# EasyEDA Pro project OctoSlime_Haptics_LED_Driver_Imported.eprj

# Schematic OctoSlime
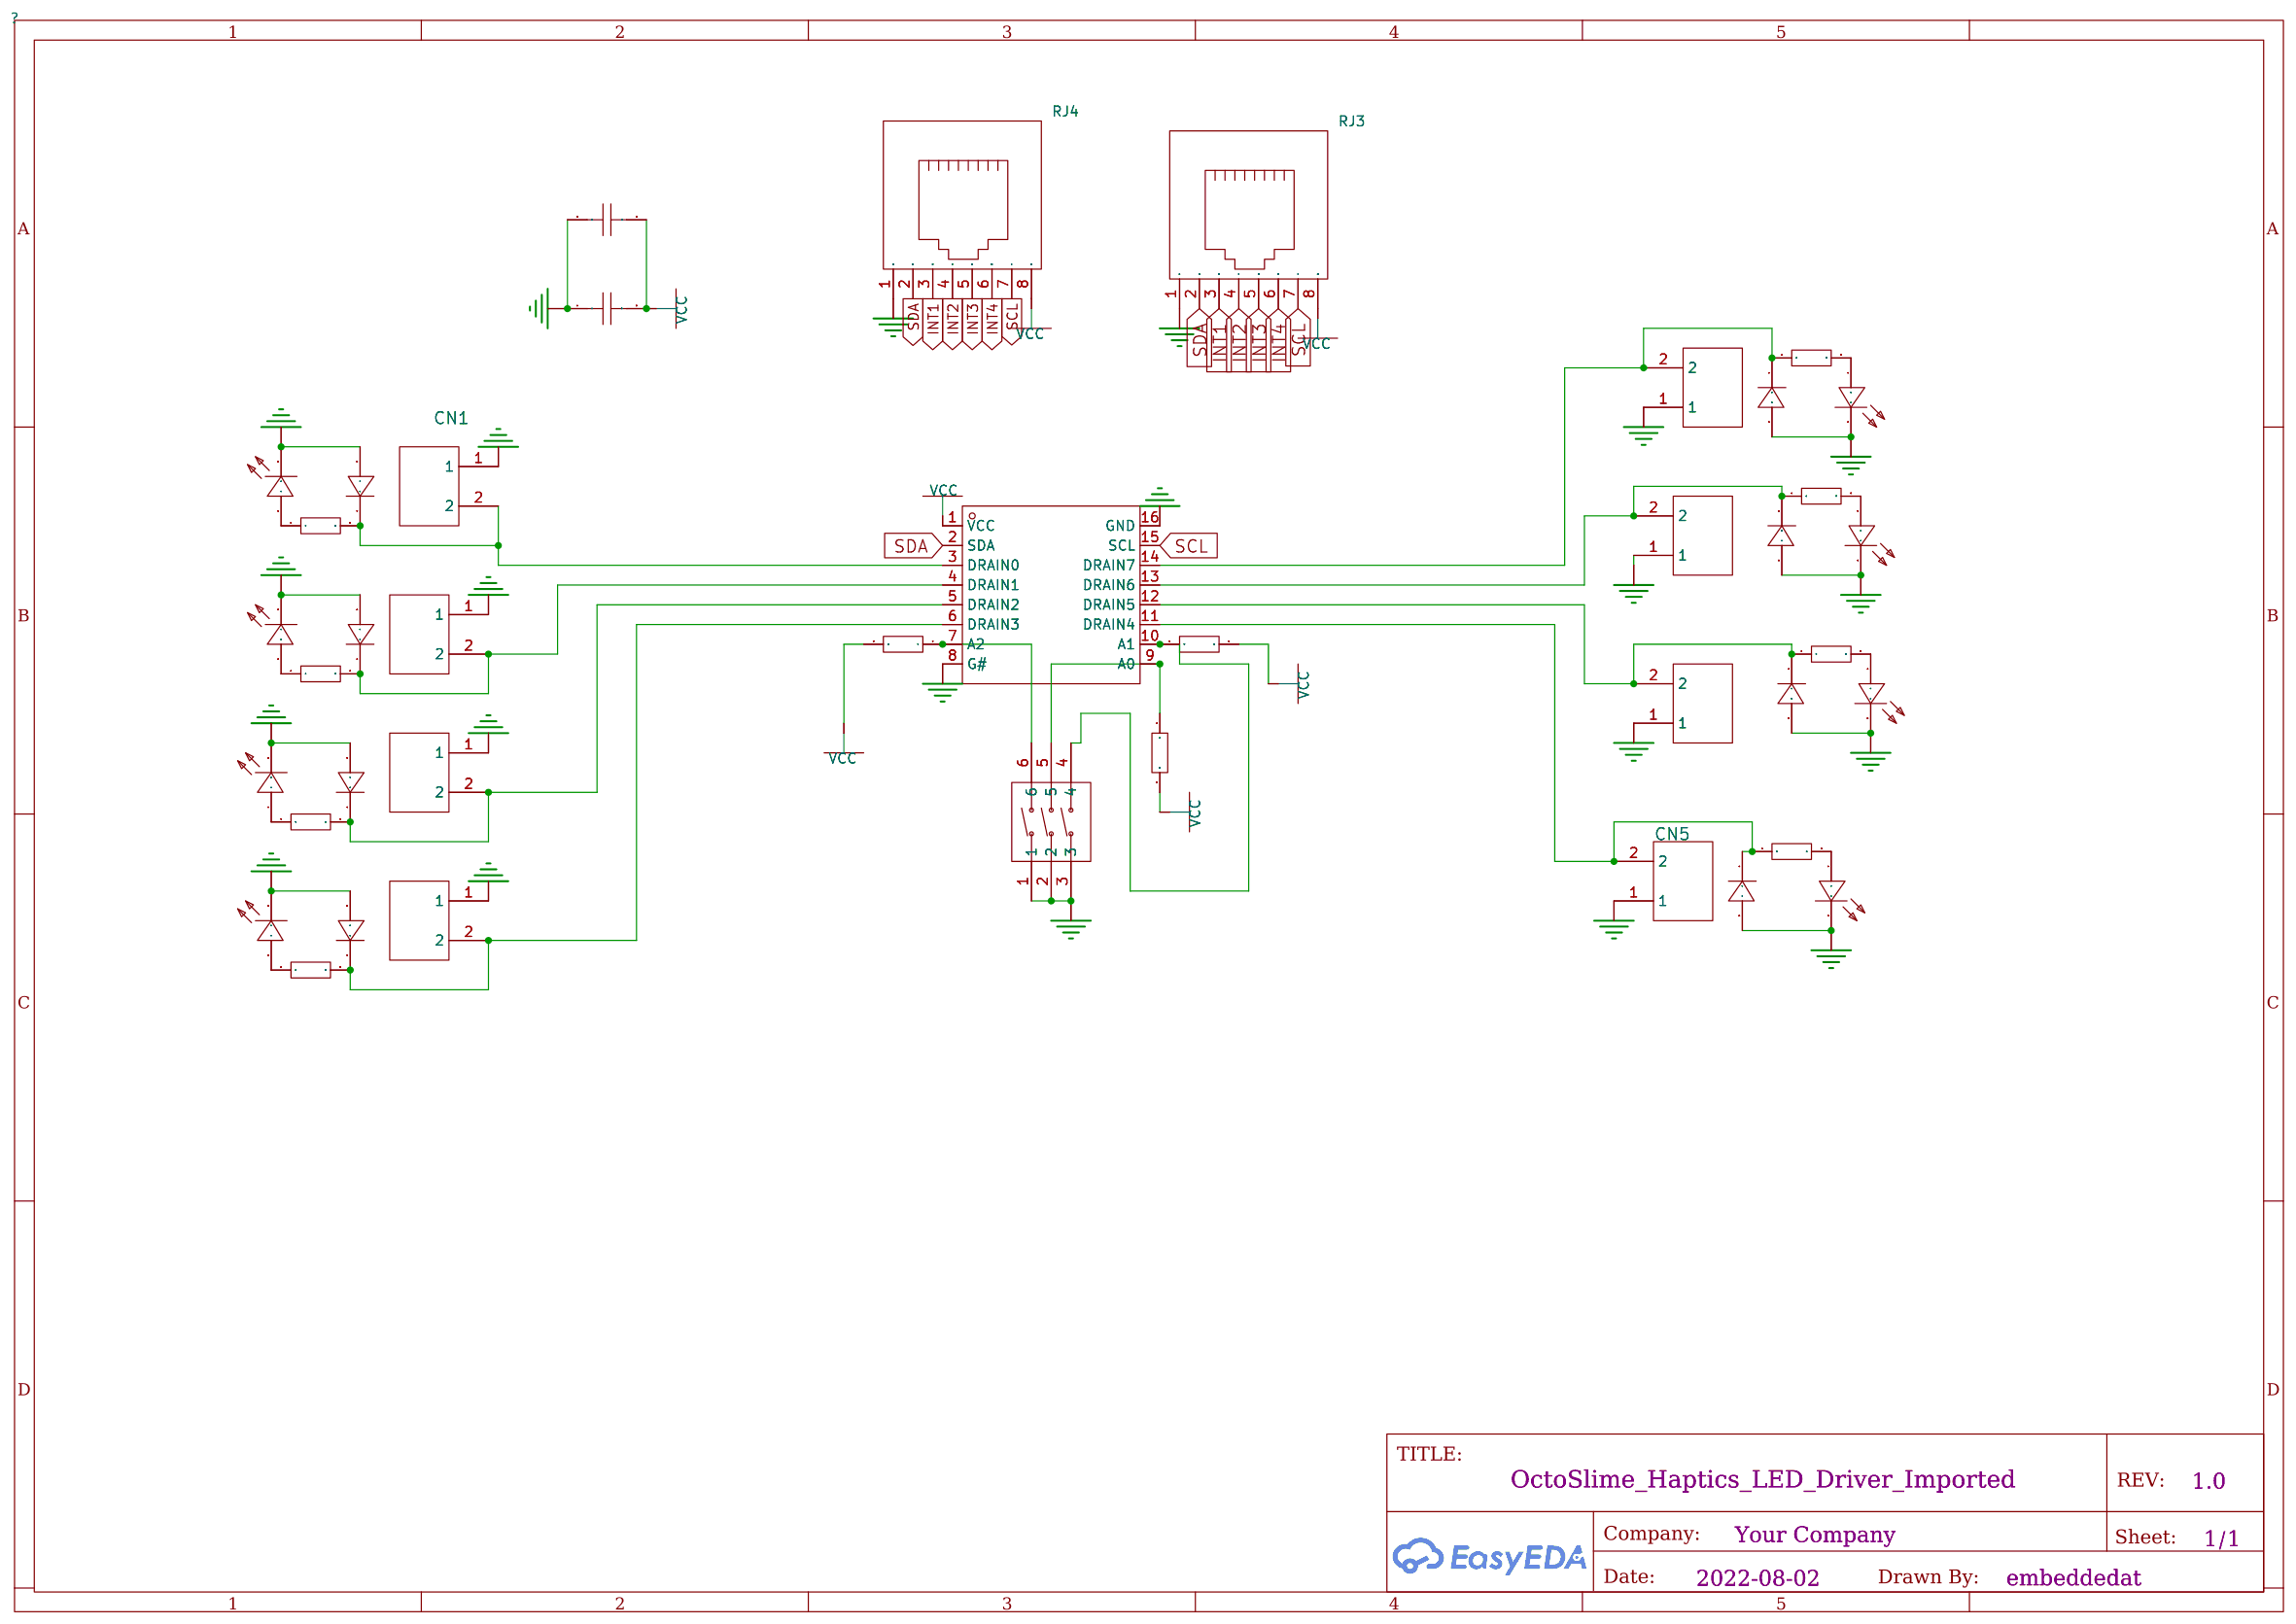
[diagram p0: schematic sheet]

## Parts
C3  47uF  [C1206]
C4  100nF  [C0402]
CN1  B2B-PH-K-S(LF)(SN)  [CONN-TH_B2B-PH-K-S]
CN2  B2B-PH-K-S(LF)(SN)  [CONN-TH_B2B-PH-K-S]
CN3  B2B-PH-K-S(LF)(SN)  [CONN-TH_B2B-PH-K-S]
CN4  B2B-PH-K-S(LF)(SN)  [CONN-TH_B2B-PH-K-S]
CN5  B2B-PH-K-S(LF)(SN)  [CONN-TH_B2B-PH-K-S]
CN6  B2B-PH-K-S(LF)(SN)  [CONN-TH_B2B-PH-K-S]
CN7  B2B-PH-K-S(LF)(SN)  [CONN-TH_B2B-PH-K-S]
CN8  B2B-PH-K-S(LF)(SN)  [CONN-TH_B2B-PH-K-S]
D9  -  [DO-214AC_L4.3-W2.7-LS5.3-RD]
D10  -  [DO-214AC_L4.3-W2.7-LS5.3-RD]
D11  -  [DO-214AC_L4.3-W2.7-LS5.3-RD]
D12  -  [DO-214AC_L4.3-W2.7-LS5.3-RD]
D13  -  [DO-214AC_L4.3-W2.7-LS5.3-RD]
D14  -  [DO-214AC_L4.3-W2.7-LS5.3-RD]
D15  -  [DO-214AC_L4.3-W2.7-LS5.3-RD]
D16  -  [DO-214AC_L4.3-W2.7-LS5.3-RD]
LED9  -  [LED0603-R-RD]
LED10  -  [LED0603-R-RD]
LED11  -  [LED0603-R-RD]
LED12  -  [LED0603-R-RD]
LED13  -  [LED0603-R-RD]
LED14  -  [LED0603-R-RD]
LED15  -  [LED0603-R-RD]
LED16  -  [LED0603-R-RD]
R1  1kΩ  [R0603]
R2  1kΩ  [R0603]
R12  330Ω  [R0603]
R13  330Ω  [R0603]
R14  330Ω  [R0603]
R15  330Ω  [R0603]
R16  330Ω  [R0603]
R17  330Ω  [R0603]
R18  330Ω  [R0603]
R19  330Ω  [R0603]
R20  1kΩ  [R0603]
RJ3  -  [RJ45-TH_R-RJ45R08P-A004]
RJ4  -  [RJ45-TH_R-RJ45R08P-A004]
SW1  EM-03KP  [SW-SMD_EM-03KP]
U1  TPIC2810DRG4  [SOIC-16_L9.9-W3.9-P1.27-LS6.0-BL]  (no BOM)

## Library data of the parts
C3 = CL31A476MPHNNNE: 容值:47uF;精度:±20%;额定电压:10V;温度系数:X5R;; LCSC Part Name: 47uF ±20% 10V; Supplier Part: C96123; Manufacturer: SAMSUNG(三星); Supplier Footprint: 1206; JLCPCB Part Class: Basic Part; Datasheet: https://atta.szlcsc.com/upload/public/pdf/source/20170228/1488267692219.pdf; Supplier: LCSC; Tolerance: ±20%; Voltage Rated: 10V; Temperature Coefficient: X5R
C4 = CL05B104KB54PNC: 容值:100nF;精度:±10%;额定电压:50V;温度系数:X7R;; LCSC Part Name: 100nF ±10% 50V; Supplier Part: C307331; Manufacturer: SAMSUNG(三星); Supplier Footprint: 0402; JLCPCB Part Class: Basic Part; Datasheet: https://atta.szlcsc.com/upload/public/pdf/source/20181009/C307331_222F7C870FD3EA5F46F538B483443886.pdf; Supplier: LCSC; Tolerance: ±10%; Voltage Rated: 50V; Temperature Coefficient: X7R
CN1-CN8 = B2B-PH-K-S(LF)(SN): link: https://item.szlcsc.com/142630.html; 3DModel: CONN-TH_PH2.00-LI-2P; Supplier: LCSC; Manufacturer: JST; Supplier Part: C131337; JLCPCB Part Class: Extended Part
D9-D16 = M7_C95872: 二极管配置:-;直流反向耐压(Vr):1kV;平均整流电流(Io):1A;正向压降(Vf):1.1V@1A;反向电流(Ir):5A@1kV;; LCSC Part Name: 1kV 1A 1.1V@1A GPP; Supplier Part: C95872; Manufacturer: MDD; Manufacturer Part: M7; Supplier Footprint: SMA(DO-214AC); JLCPCB Part Class: Basic Part; Datasheet: https://atta.szlcsc.com/upload/public/pdf/source/20170221/1487670316366.pdf; Supplier: LCSC; Reverse Voltage (Vr): 1kV; Average Rectified Current (Io): 1A; Forward Voltage (Vf@If): 1.1V@1A; Reverse Leakage Current: 5A@1kV
LED9-LED16 = KT-0603R: 发光颜色:红灯;二极管配置:-;透镜颜色:-;主波长:-;峰值波长:-;色温:-;光通量(25时):-;测试电流:-;正向电压(VF):-;发光强度:-;功率:-;发光角度:-;安装方式:-;工作温度:-40~+85;; LCSC Part Name: 红灯 0603 (90~100mcd); Supplier Part: C2286; Manufacturer: KENTO; Supplier Footprint: 0603; JLCPCB Part Class: Basic Part; Datasheet: https://atta.szlcsc.com/upload/public/pdf/source/20160616/1466072038404.pdf; Supplier: LCSC; Emitted Color: 红灯; Operating Temperature: -40~+85
R1 R2 R20 = 0603WAF1001T5E: 电阻类型:厚膜电阻;阻值:1kΩ;精度:±1%;功率:1/10W;温度系数:±100ppm/;最大工作电压:75V;工作温度范围:-55~+155;; LCSC Part Name: 1kΩ ±1%; Supplier Part: C21190; Manufacturer: UNI-ROYAL(厚声); Supplier Footprint: 0603; JLCPCB Part Class: Basic Part; Datasheet: https://atta.szlcsc.com/upload/public/pdf/source/20200306/C422600_1E6D84923E4A46A82E41ADD87F860B5C.pdf; Supplier: LCSC; Type: 厚膜电阻; Tolerance: ±1%; Power(Watts): 1/10W; Temperature Coefficient: ±100ppm/; Overload Voltage (Max): 75V; Operating Temperature Range: -55~+155
R12-R19 = 0603WAF3300T5E: 电阻类型:厚膜电阻;阻值:330Ω;精度:±1%;功率:1/10W;温度系数:±100ppm/;最大工作电压:75V;工作温度范围:-55~+155;; LCSC Part Name: 330Ω ±1%; Supplier Part: C23138; Manufacturer: UNI-ROYAL(厚声); Supplier Footprint: 0603; JLCPCB Part Class: Basic Part; Datasheet: https://atta.szlcsc.com/upload/public/pdf/source/20200306/C422600_1E6D84923E4A46A82E41ADD87F860B5C.pdf; Supplier: LCSC; Type: 厚膜电阻; Tolerance: ±1%; Power(Watts): 1/10W; Temperature Coefficient: ±100ppm/; Overload Voltage (Max): 75V; Operating Temperature Range: -55~+155
RJ3 RJ4 = R-RJ45R08P-A004: 连接器类型:RJ插座;USOC代码:RJ45;端口数量:1;等级:-;安装方式:弯插;屏蔽:无;LED:无;工作温度范围:0~+70;; LCSC Part Name: RJ45 8P/8C 全塑 无灯; Supplier Part: C385834; Manufacturer: Ckmtw(灿科盟); Supplier Footprint: 插件; JLCPCB Part Class: Extended Part; Datasheet: https://atta.szlcsc.com/upload/public/pdf/source/20210127/C385834_05A472B070A4DC4A7A2338A5364B5FF5.pdf; Supplier: LCSC; Connector Type: RJ插座; USOC Codes: RJ45; Number of Ports: 1; Mounting Style: 弯插; Shielding: 无; LED: 无; Operating Temperature Range: 0~+70
SW1 = EM-03KP: link: https://item.szlcsc.com/140371.html; 3DModel: SW-SMD_EM-03KP-L8.6-W6.3-H4.8-P2.54-LS10.0; Supplier: LCSC; Manufacturer: HRO; Supplier Part: C129079; JLCPCB Part Class: Extended Part
U1 = TPIC2810DRG4: 3DModel: SOIC-16_L9.9-W3.9-H1.8-LS6.0-P1.27; Supplier: LCSC; Supplier Part: C2678987; Manufacturer: TI(德州仪器); JLCPCB Part Class: Extended Part

## Nets
GND: C3.1 C4.1 CN1.1 CN2.1 CN3.1 CN4.1 CN5.1 CN6.1 CN7.1 CN8.1 D9.2(A) D10.2(A) D11.2(A) D12.2(A) D13.2(A) D14.2(A) D15.2(A) D16.2(A) LED9.2(K) LED10.2(K) LED11.2(K) LED12.2(K) LED13.2(K) LED14.2(K) LED15.2(K) LED16.2(K) RJ3.1 RJ4.1 SW1.1 SW1.2 SW1.3 U1.8(G#) U1.16(GND)
VCC: C3.2 C4.2 R1.2 R2.2 R20.1 RJ3.8 RJ4.8 U1.1(VCC)
INT1: RJ3.3 RJ4.3
INT2: RJ3.4 RJ4.4
INT3: RJ3.5 RJ4.5
INT4: RJ3.6 RJ4.6
SCL: RJ3.7 RJ4.7 U1.15(SCL)
SDA: RJ3.2 RJ4.2 U1.2(SDA)
$1N1698: R20.2 SW1.4 U1.10(A1)
$1N1704: R1.1 SW1.5 U1.9(A0)
$1N1718: R2.1 SW1.6 U1.7(A2)
$1N1725: CN1.2 D16.1(K) R19.2 U1.3(DRAIN0)
$1N1741: CN2.2 D15.1(K) R18.2 U1.4(DRAIN1)
$1N1752: CN3.2 D14.1(K) R17.2 U1.5(DRAIN2)
$1N1760: CN4.2 D13.1(K) R16.2 U1.6(DRAIN3)
$1N1840: CN8.2 D12.1(K) R12.1 U1.14(DRAIN7)
$1N1848: CN7.2 D11.1(K) R13.1 U1.13(DRAIN6)
$1N1856: CN6.2 D10.1(K) R14.1 U1.12(DRAIN5)
$1N1864: CN5.2 D9.1(K) R15.1 U1.11(DRAIN4)
$1N7443: LED12.1(A) R15.2
$1N7487: LED11.1(A) R14.2
$1N7531: LED10.1(A) R13.2
$1N7596: LED9.1(A) R12.2
$1N7750: LED16.1(A) R16.1
$1N7776: LED15.1(A) R17.1
$1N7810: LED14.1(A) R18.1
$1N7836: LED13.1(A) R19.1

# Board PCB_PCB_OctoSlime_2022-08-02
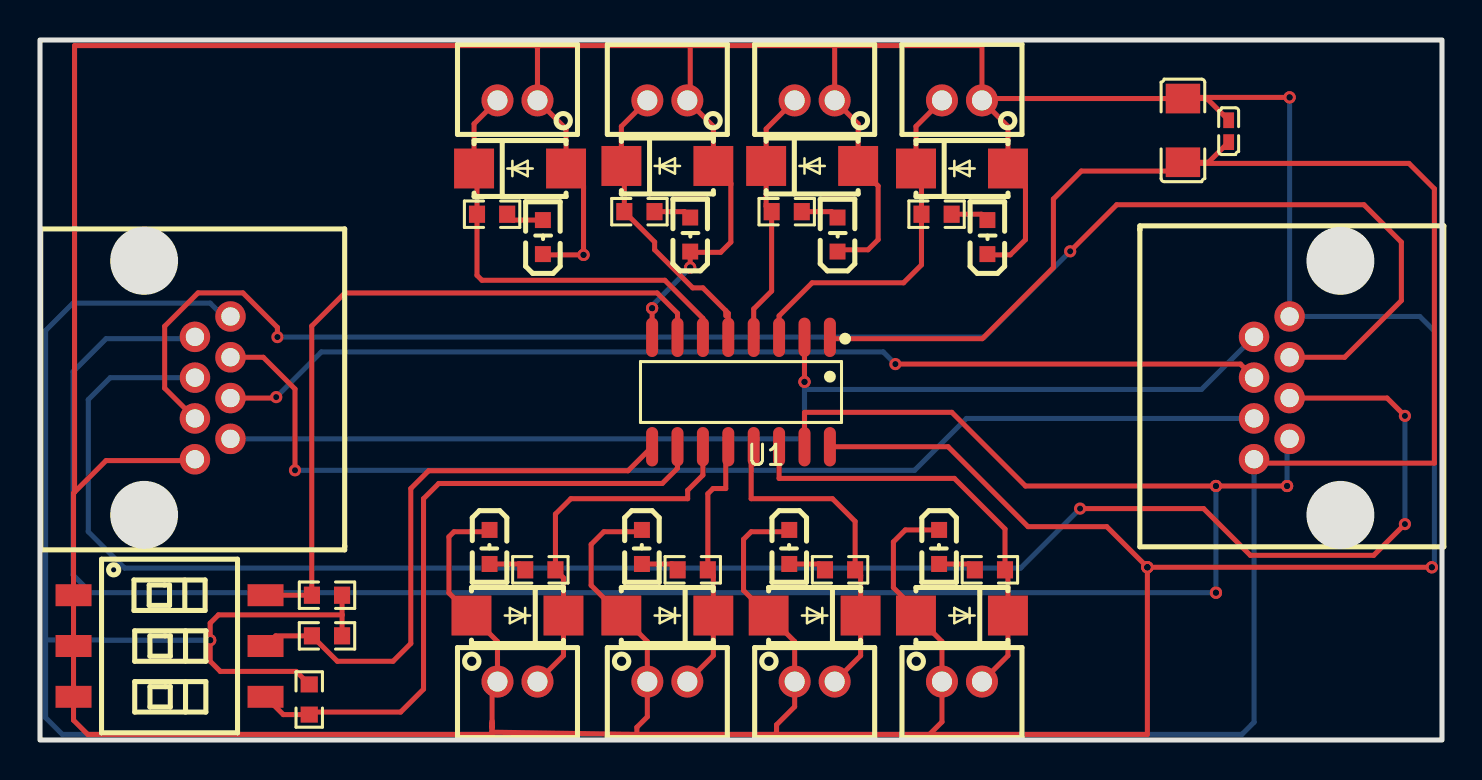
[diagram p1: board, top side]
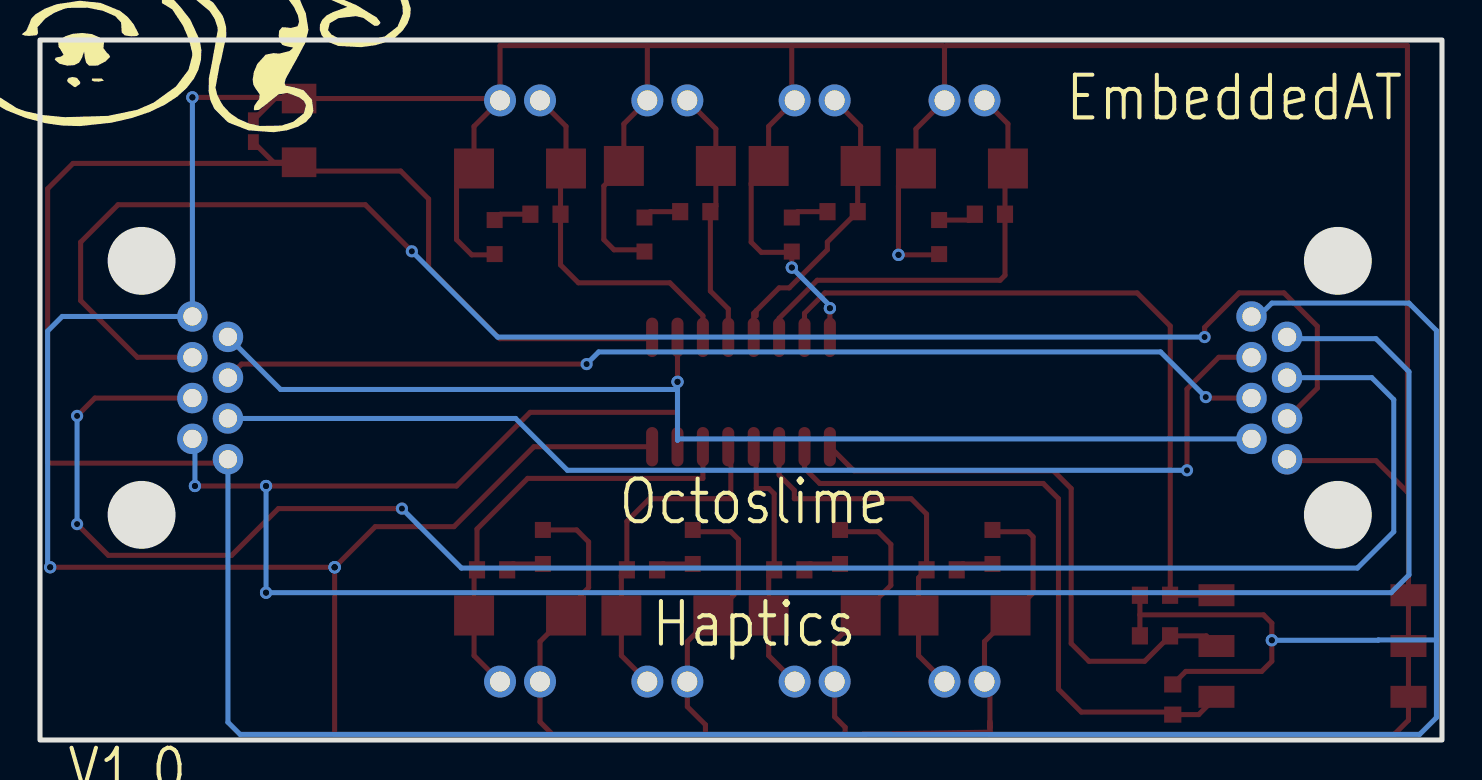
[diagram p2: board, bottom side, seen from below]

Outline 70.1 x 35 mm; copper layers: Top Layer, Bottom Layer. Coordinates in mm from the lower left corner of the outline.
Outline path: rectangle 0,35 70.1,0
Stack: Top Layer 0.035mm / Dielectric1 1.51mm FR4 er 4.5 / Bottom Layer 0.035mm

## Design rules (mm)
spacing Default (default): track to track 0.152, other pairs 0 to 0.152
track width Default (default): min 0.254, default 0.254, max 25.4
differential pair differentialPair (default): width min 0.127, default 0.254, max 2.54; gap min 0.152, default 0.152
via Default (default): diameter min 0.61, default 0.61, max 100.025; hole min 0.305, default 0.305, max 59.995

## Placement (name value [footprint] x y rotation side)
C3  47uF  [C1206]  57.15 30.48 270 top
C4  100nF  [C0402]  59.44 30.44 270 top
CN1  B2B-PH-K-S(LF)(SN)  [CONN-TH_B2B-PH-K-S]  46.1 31.98 0 top
CN2  B2B-PH-K-S(LF)(SN)  [CONN-TH_B2B-PH-K-S]  38.73 31.98 0 top
CN3  B2B-PH-K-S(LF)(SN)  [CONN-TH_B2B-PH-K-S]  31.37 31.98 0 top
CN4  B2B-PH-K-S(LF)(SN)  [CONN-TH_B2B-PH-K-S]  23.88 31.98 0 top
CN5  B2B-PH-K-S(LF)(SN)  [CONN-TH_B2B-PH-K-S]  23.88 2.92 180 top
CN6  B2B-PH-K-S(LF)(SN)  [CONN-TH_B2B-PH-K-S]  31.37 2.92 180 top
CN7  B2B-PH-K-S(LF)(SN)  [CONN-TH_B2B-PH-K-S]  38.73 2.92 180 top
CN8  B2B-PH-K-S(LF)(SN)  [CONN-TH_B2B-PH-K-S]  46.1 2.92 180 top
D9  -  [DO-214AC_L4.3-W2.7-LS5.3-RD]  23.88 6.22 180 top
D10  -  [DO-214AC_L4.3-W2.7-LS5.3-RD]  31.37 6.22 180 top
D11  -  [DO-214AC_L4.3-W2.7-LS5.3-RD]  38.73 6.22 180 top
D12  -  [DO-214AC_L4.3-W2.7-LS5.3-RD]  46.1 6.22 180 top
D13  -  [DO-214AC_L4.3-W2.7-LS5.3-RD]  24 28.58 0 top
D14  -  [DO-214AC_L4.3-W2.7-LS5.3-RD]  31.37 28.7 0 top
D15  -  [DO-214AC_L4.3-W2.7-LS5.3-RD]  38.61 28.7 0 top
D16  -  [DO-214AC_L4.3-W2.7-LS5.3-RD]  46.1 28.58 0 top
LED9  -  [LED0603-R-RD]  44.96 9.65 270 top
LED10  -  [LED0603-R-RD]  37.46 9.65 270 top
LED11  -  [LED0603-R-RD]  30.1 9.65 270 top
LED12  -  [LED0603-R-RD]  22.48 9.65 270 top
LED13  -  [LED0603-R-RD]  47.37 25.15 90 top
LED14  -  [LED0603-R-RD]  39.88 25.27 90 top
LED15  -  [LED0603-R-RD]  32.51 25.27 90 top
LED16  -  [LED0603-R-RD]  25.15 25.15 90 top
R1  1kΩ  [R0603]  14.35 5.21 0 top
R2  1kΩ  [R0603]  14.35 7.24 0 top
R12  330Ω  [R0603]  47.5 8.51 180 top
R13  330Ω  [R0603]  40.01 8.51 180 top
R14  330Ω  [R0603]  32.64 8.51 180 top
R15  330Ω  [R0603]  25.02 8.51 180 top
R16  330Ω  [R0603]  22.61 26.29 180 top
R17  330Ω  [R0603]  29.97 26.42 180 top
R18  330Ω  [R0603]  37.34 26.42 180 top
R19  330Ω  [R0603]  44.83 26.29 180 top
R20  1kΩ  [R0603]  13.46 2.02 270 top
RJ3  -  [RJ45-TH_R-RJ45R08P-A004]  61.59 17.61 90 top
RJ4  -  [RJ45-TH_R-RJ45R08P-A004]  8.64 17.61 270 top
SW1  EM-03KP  [SW-SMD_EM-03KP]  6.48 4.7 270 top
U1  TPIC2810DRG4  [SOIC-16_L9.9-W3.9-P1.27-LS6.0-BL]  35.05 17.4 180 top

## Footprints (pads in the part's own frame, mm; a bottom-side part is the same pattern mirrored in y, then rotated)
C0402
  rect 0.79x0.541 smd: 1(-0.546,0) 2(0.546,0)
C1206
  rect 1.486x1.727 smd: 1(-1.593,0) 2(1.593,0)
CONN-TH_B2B-PH-K-S
  round 1.6 hole 1: 1(1,0) 2(-1,0)
DO-214AC_L4.3-W2.7-LS5.3-RD
  rect 1.999x1.999 smd: 1(-2.299,0) 2(2.301,0)
LED0603-R-RD
  rect 0.8x0.8 smd: 1(0.851,0) 2(-0.851,0)
R0603
  rect 0.807x0.864 smd: 1(-0.754,0) 2(0.754,0)
RJ45-TH_R-RJ45R08P-A004
  round 1.524 hole 0.914: 1(3.571,-0.889) 2(2.55,0.889) 3(1.529,-0.889) 4(0.51,0.889) 5(-0.51,-0.889) 6(-1.529,0.889) 7(-2.55,-0.889) 8(-3.568,0.889)
SOIC-16_L9.9-W3.9-P1.27-LS6.0-BL
  oval 0.602x1.971 smd: 1(-4.445,-2.736) 2(-3.175,-2.736) 3(-1.905,-2.736) 4(-0.635,-2.736) 5(0.635,-2.736) 6(1.905,-2.736) 7(3.175,-2.736) 8(4.445,-2.736) 9(4.445,2.736) 10(3.175,2.736) 11(1.905,2.736) 12(0.635,2.736) 13(-0.635,2.736) 14(-1.905,2.736) 15(-3.175,2.736) 16(-4.445,2.736)
SW-SMD_EM-03KP
  rect 1.1x1.8 smd: 1(-2.54,-4.8) 2(0,-4.8) 3(2.54,-4.8) 4(2.54,4.8) 5(0,4.8) 6(-2.54,4.8)

## Nets
As in the schematic.

## Via types
v1: diameter 0.61, hole 0.305, Top Layer to Bottom Layer, 32 vias

## Routing (per net, layer and track width the routed paths; a pad name or vN(x,y) marks a point on that pad's centre or on a via; arc(x,y) is an arc through that point)
GND: length 340.8
  Top Layer w0.254: LED11.2 30.01,10.41 28.19,10.41 27.56,9.78 27.56,7.73 D10.2 30.37,4.92 CN6.1 30.37,1.16 29.84,0.64 29.84,0.28 ; 44.48,0.28 36.73,0.28 ; 44.48,0.28 45.1,0.91 CN8.1 45.1,4.92 D12.2 43.8,6.49 42.67,7.62 42.67,9.91 43.27,10.5 LED9.2 ; 44.48,0.28 55.37,0.28 v1(55.37,8.64) ; 36.73,0.28 29.84,0.28 ; 36.73,0.28 36.83,0.38 36.83,0.76 37.73,1.67 CN7.1 37.73,4.92 D11.2 35.18,7.48 35.18,10.03 35.56,10.41 37.38,10.41 LED10.2 ; 29.84,0.28 22.6,0.39 ; 22.6,0.82 22.6,0.7 ; 22.6,0.82 22.61,0.93 ; 22.6,0.82 22.6,0.82 22.6,0.7 ; 22.6,0.7 22.61,0.7 22.61,0.64 22.6,0.63 ; 22.6,0.7 22.6,0.63 ; LED14.2 39.97,24.51 41.4,24.51 41.91,25.02 41.91,27.7 D15.2 40.91,30.81 CN2.1 39.73,34.72 ; RJ4.1 7.68,13.97 3.3,13.97 1.73,12.4 ; 39.73,34.72 32.51,34.72 ; 39.73,34.72 47.1,34.72 CN1.1 ; 32.51,34.72 32.51,32.12 CN3.1 33.67,30.68 33.67,28.7 34.54,27.83 34.54,24.89 34.04,24.38 32.55,24.38 LED15.2 v1(32.51,23.62) ; 32.51,34.72 24.97,34.72 24.88,34.63 ; v1(55.37,8.64) 53.34,10.67 49.4,10.67 45.41,14.66 U1.16 ; v1(55.37,8.64) v1(69.6,8.64) ; 57.54,32.07 C3.1 47.19,32.07 CN1.1 ; 57.54,32.07 57.59,32.13 v1(62.48,32.13) ; 57.54,32.07 58.35,32.07 C4.1 ; LED16.2 25.18,24.26 v1(27.18,24.26) 27.18,27.7 D13.2 26.3,30.55 CN4.1 24.88,34.63 ; 22.61,0.93 22.61,0.83 ; 22.61,0.93 22.61,2.65 CN5.1 22.88,4.92 D9.2 20.45,7.35 20.45,10.16 20.7,10.41 22.39,10.41 LED12.2 ; 22.6,0.39 22.6,0.39 22.6,0.63 ; 22.6,0.39 22.6,0.63 ; 22.6,0.39 22.6,0.28 2.39,0.28 1.68,0.99 SW1.3 SW1.2 SW1.1 1.68,12.34 1.73,12.4 ; CN1.1 48.4,30.68 48.4,28.58 49.28,27.7 49.28,25.02 48.51,24.26 47.41,24.26 LED13.2 ; 24.88,34.63 24.78,34.72 1.73,34.72 1.73,12.4 ; v1(30.61,21.59) U1.8
  Bottom Layer w0.254: v1(32.51,23.62) 30.61,21.72 v1(30.61,21.59) ; v1(62.48,32.13) RJ3.1 68.99,21.18 69.72,20.45 69.72,8.76 v1(69.6,8.64)
VCC: length 189.6
  Top Layer w0.254: 57.49,28.89 57.55,28.83 68.45,28.83 69.72,27.56 69.72,13.84 60.9,13.84 60.71,14.04 ; 57.49,28.89 58.43,28.89 C4.2 ; 57.49,28.89 C3.2 56.71,28.45 52.07,28.45 50.67,27.05 50.67,23.62 47.12,20.07 39.57,20.07 U1.1 ; R2.2 15.11,6.26 ; 15.11,6.26 8.92,6.26 8.51,5.84 v1(8.51,4.99) 8.51,3.94 9.02,3.43 12.81,3.43 R20.1 ; 15.11,6.26 R1.2
  Bottom Layer w0.254: v1(8.51,4.99) 3.19,4.99 3.18,5 0.28,5 ; 0.28,5 0.28,1.12 1.12,0.28 60.1,0.28 60.71,0.89 60.71,14.04 ; 0.28,5 0.28,20.47 1.65,21.84 8.51,21.84 9.18,21.18 RJ4.8
INT1: length 82.2
  Top Layer w0.254: v1(51.51,24.44) 53.84,26.76 66.2,26.76 68.07,24.89 68.07,21.97 65.24,19.14 RJ3.3 ; RJ4.3 6.23,17.59 6.23,20.69 7.9,22.36 10.15,22.36 11.87,20.63 v1(11.87,20.15)
  Bottom Layer w0.254: v1(51.51,24.44) 47.22,20.15 v1(11.87,20.15)
INT2: length 52.7
  Top Layer w0.254: RJ4.4 11.76,17.1 v1(11.81,17.14) ; 60.71,18.12 60.03,18.8 v1(42.77,18.8)
  Bottom Layer w0.254: v1(11.81,17.14) 14.07,19.4 42.16,19.4 v1(42.77,18.8)
INT3: length 93.4
  Top Layer w0.254: v1(68.25,10.8) 66.69,9.23 60.52,9.23 58.18,11.57 v1(52.01,11.57) ; v1(68.25,16.2) 67.36,17.1 RJ3.5
  Bottom Layer w0.254: RJ4.5 3.51,18.12 2.41,17.02 2.41,10.41 4.23,8.6 49.03,8.6 v1(52.01,11.57) ; v1(68.25,10.8) v1(68.25,16.2)
INT4: length 57
  Top Layer w0.254: RJ4.6 11.16,19.14 12.75,17.55 v1(12.75,13.48)
  Bottom Layer w0.254: v1(12.75,13.48) 43.73,13.48 46.32,16.08 60.71,16.08
SCL: length 109.6
  Top Layer w0.254: U1.15 38.23,16.38 45.59,16.38 49.28,12.7 v1(58.8,12.7) v1(62.36,12.7)
  Bottom Layer w0.254: v1(62.36,12.7) 62.36,14.93 RJ3.7 ; v1(58.8,12.7) v1(58.8,7.37) 2.54,7.37 1.65,8.25 1.65,18.42 3.3,20.07 7.66,20.07 RJ4.7
SDA: length 57.5
  Top Layer w0.254: v1(38.23,17.91) U1.2
  Bottom Layer w0.254: 38.23,17.65 v1(38.23,17.91) ; 38.23,17.65 38.23,14.99 38.16,15.06 RJ4.2 ; 38.23,17.65 38.35,17.53 58.08,17.53 60.71,20.16
$1N1698: length 32.7
  Top Layer w0.254: U1.10 31.88,13.59 31.11,12.83 19.94,12.83 19.18,12.06 19.18,2.54 18.03,1.4 13.59,1.4 R20.2 12.17,1.27 SW1.4
$1N1704: length 29
  Top Layer w0.254: U1.9 29.41,13.46 19.43,13.46 18.54,12.57 18.54,4.83 17.65,3.94 14.87,3.94 R1.1 11.78,5.21 SW1.5
$1N1718: length 36.4
  Top Layer w0.254: U1.7 31.88,21.34 30.86,22.35 15.24,22.35 13.59,20.7 13.59,7.25 R2.1 SW1.6
$1N1725: length 18.1
  Top Layer w0.254: U1.3 36.96,21.21 38.61,22.86 43.18,22.86 44.08,23.76 R19.2 44.08,28.3 D16.1 43.8,30.68 CN1.2
$1N1741: length 12.9
  Top Layer w0.254: U1.4 35.69,21.55 36.58,22.45 R18.2 36.31,26.69 D15.1 36.31,30.55 CN2.2
$1N1752: length 15.1
  Top Layer w0.254: 34.29,21.46 34.42,21.34 U1.5 ; 34.29,21.46 33.15,22.61 32.64,22.61 30.73,24.51 30.73,24.9 R17.2 29.22,28.55 D14.1 29.07,30.68 CN3.2 ; 34.29,21.46 34.29,21.21
$1N1760: length 22.4
  Top Layer w0.254: U1.6 33.15,21.08 31.24,22.99 22.1,22.99 21.85,23.23 R16.2 21.85,28.43 D13.1 21.7,30.81 CN4.2
$1N1840: length 22.2
  Top Layer w0.254: CN8.2 48.4,4.22 D12.1 48.4,8.36 R12.1 48.25,10.55 45.72,13.08 36.96,13.08 U1.14
$1N1848: length 17
  Top Layer w0.254: CN7.2 41.03,4.22 D11.1 41.03,8.23 R13.1 40.76,10.93 39.62,12.06 35.56,12.06 35.56,14.54 U1.13
$1N1856: length 13.2
  Top Layer w0.254: CN6.2 33.67,4.22 D10.1 33.67,8.23 R14.1 33.39,12.31 33.65,12.57 34.29,12.57 34.29,14.54 U1.12
$1N1864: length 18.9
  Top Layer w0.254: CN5.2 26.17,4.22 D9.1 26.17,8.11 R15.1 25.77,11.3 26.54,12.06 32.39,12.06 32.39,12.48 33.15,13.25 U1.11
$1N7443: length 1.9
  Top Layer w0.254: LED12.1 23.97,8.8 R15.2
$1N7487: length 1.9
  Top Layer w0.254: R14.2 31.59,8.8 LED11.1
$1N7531: length 1.9
  Top Layer w0.254: R13.2 38.96,8.8 LED10.1
$1N7596: length 1.9
  Top Layer w0.254: LED9.1 46.45,8.8 R12.2
$1N7750: length 1.9
  Top Layer w0.254: LED16.1 23.65,26 R16.1
$1N7776: length 1.9
  Top Layer w0.254: LED15.1 32.22,26.42 R17.1
$1N7810: length 1.9
  Top Layer w0.254: LED14.1 39.59,26.42 R18.1
$1N7836: length 1.9
  Top Layer w0.254: R19.1 47.08,26.29 LED13.1

## Text on the board
Bottom Silkscreen Layer: EmbeddedAT | Haptics | Octoslime | V1.0
